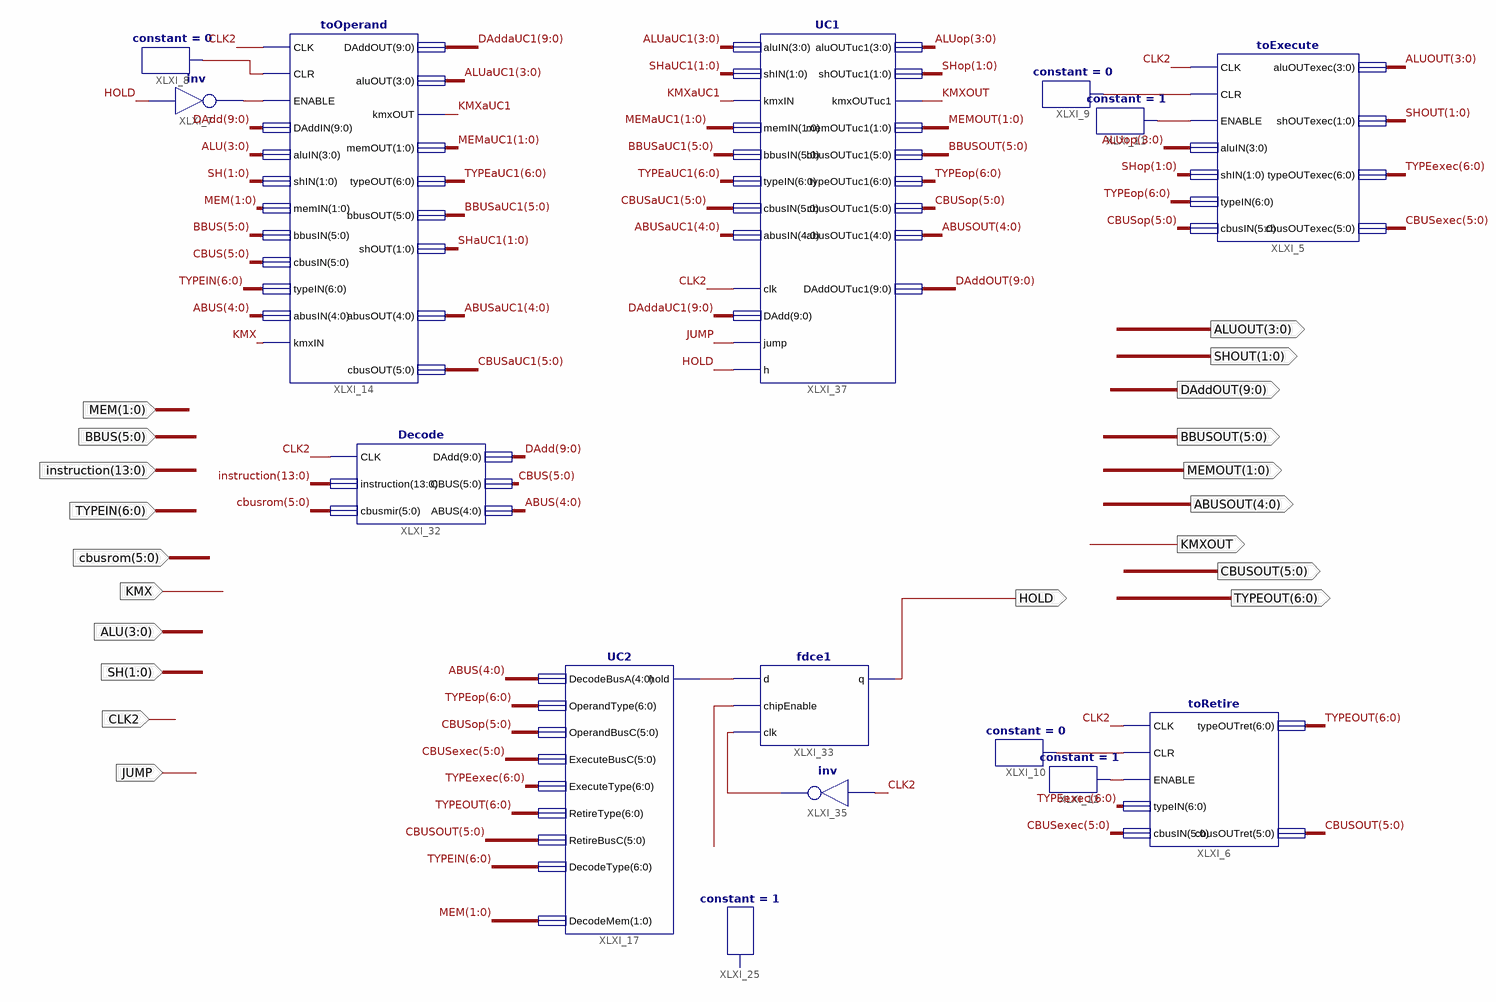
[diagram p0: schematic sheet 1]
// Xilinx ISE schematic Tuberia.sch (artix7) as structural Verilog: 15 symbols, 20 ports
module Tuberia (
  input  CLK2,
  input  [3:0] ALU,
  input  [1:0] SH,
  input  [1:0] MEM,
  input  [5:0] BBUS,
  input  [6:0] TYPEIN,
  input  KMX,
  input  [13:0] instruction,
  input  [5:0] cbusrom,
  input  JUMP,
  output [9:0] DAddOUT,
  output [5:0] BBUSOUT,
  output [1:0] MEMOUT,
  output [4:0] ABUSOUT,
  output KMXOUT,
  output [3:0] ALUOUT,
  output [1:0] SHOUT,
  output [5:0] CBUSOUT,
  output [6:0] TYPEOUT,
  output HOLD
);

  wire KMXaUC1, XLXN_2, XLXN_11, XLXN_49, XLXN_50, XLXN_60, XLXN_61, XLXN_77, XLXN_84, XLXN_85;
  wire [1:0] MEMaUC1, SHaUC1, SHop;
  wire [3:0] ALUaUC1, ALUop;
  wire [4:0] ABUS, ABUSaUC1;
  wire [5:0] BBUSaUC1, CBUS, CBUSaUC1, CBUSexec, CBUSop;
  wire [6:0] TYPEaUC1, TYPEexec, TYPEop;
  wire [9:0] DAdd, DAddaUC1;

  not XLXI_7 (XLXN_2, HOLD);
  constant #(.CValue("0")) XLXI_8 (.O(XLXN_11));
  toExecute XLXI_5 (
    .CLK(CLK2), .CLR(XLXN_49), .ENABLE(XLXN_50), .aluIN(ALUop), .shIN(SHop), .typeIN(TYPEop),
    .cbusIN(CBUSop), .aluOUTexec(ALUOUT), .shOUTexec(SHOUT), .typeOUTexec(TYPEexec), .cbusOUTexec(CBUSexec));
  constant #(.CValue("1")) XLXI_11 (.O(XLXN_50));
  constant #(.CValue("0")) XLXI_9 (.O(XLXN_49));
  toOperand XLXI_14 (
    .CLK(CLK2), .CLR(XLXN_11), .ENABLE(XLXN_2), .DAddIN(DAdd), .aluIN(ALU), .shIN(SH), .memIN(MEM),
    .bbusIN(BBUS), .cbusIN(CBUS), .typeIN(TYPEIN), .abusIN(ABUS), .kmxIN(KMX), .DAddOUT(DAddaUC1),
    .aluOUT(ALUaUC1), .kmxOUT(KMXaUC1), .memOUT(MEMaUC1), .typeOUT(TYPEaUC1), .bbusOUT(BBUSaUC1),
    .shOUT(SHaUC1), .abusOUT(ABUSaUC1), .cbusOUT(CBUSaUC1));
  constant #(.CValue("1")) XLXI_12 (.O(XLXN_61));
  constant #(.CValue("0")) XLXI_10 (.O(XLXN_60));
  toRetire XLXI_6 (
    .CLK(CLK2), .CLR(XLXN_60), .ENABLE(XLXN_61), .typeIN(TYPEexec), .cbusIN(CBUSexec), .typeOUTret(TYPEOUT),
    .cbusOUTret(CBUSOUT));
  UC2 XLXI_17 (
    .DecodeBusA(ABUS), .OperandType(TYPEop), .OperandBusC(CBUSop), .ExecuteBusC(CBUSexec),
    .ExecuteType(TYPEexec), .RetireType(TYPEOUT), .RetireBusC(CBUSOUT), .DecodeType(TYPEIN), .hold(XLXN_77),
    .DecodeMem(MEM));
  constant #(.CValue("1")) XLXI_25 (.O(XLXN_84));
  Decode XLXI_32 (.CLK(CLK2), .instruction(instruction), .cbusmir(cbusrom), .DAdd(DAdd), .CBUS(CBUS), .ABUS(ABUS));
  fdce1 XLXI_33 (.clk(XLXN_85), .chipEnable(XLXN_84), .d(XLXN_77), .q(HOLD));
  not XLXI_35 (XLXN_85, CLK2);
  UC1 XLXI_37 (
    .aluIN(ALUaUC1), .shIN(SHaUC1), .kmxIN(KMXaUC1), .memIN(MEMaUC1), .bbusIN(BBUSaUC1), .typeIN(TYPEaUC1),
    .cbusIN(CBUSaUC1), .abusIN(ABUSaUC1), .clk(CLK2), .DAdd(DAddaUC1), .jump(JUMP), .h(HOLD),
    .aluOUTuc1(ALUop), .shOUTuc1(SHop), .kmxOUTuc1(KMXOUT), .memOUTuc1(MEMOUT), .bbusOUTuc1(BBUSOUT),
    .typeOUTuc1(TYPEop), .cbusOUTuc1(CBUSop), .abusOUTuc1(ABUSOUT), .DAddOUTuc1(DAddOUT));
endmodule
